# EAGLE schematic hauptplatine (EAGLE 6.5.0)
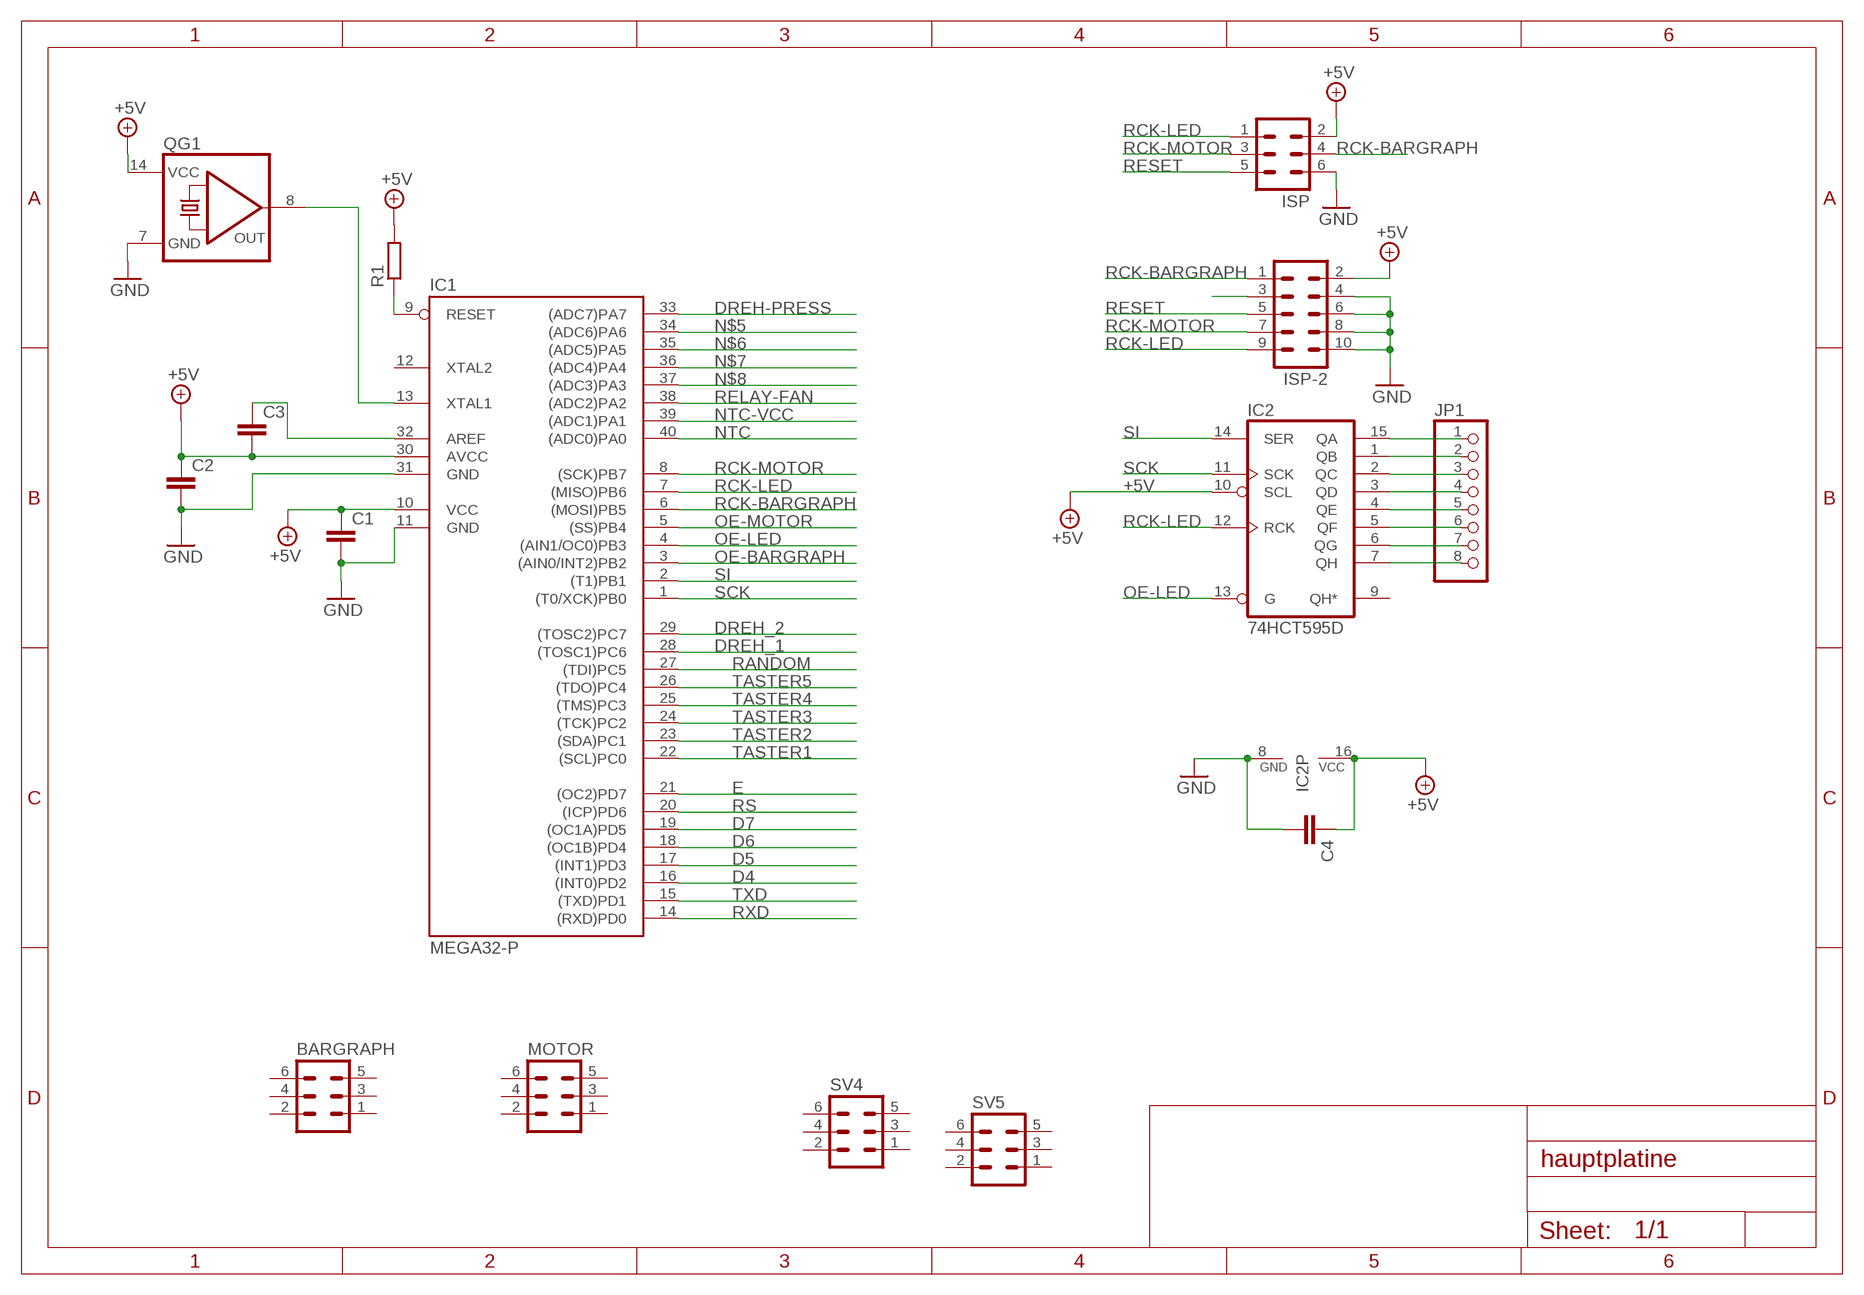
[diagram p0: schematic, sheet 1]

## Parts
BARGRAPH  ML6  [ML6]
C1  C-EU025-025X050  [C025-025X050]
C2  C-EUC0805  [C0805]
C3  C-EUC0805  [C0805]
C4  C-EU025-025X050  [C025-025X050]
IC1  MEGA32-P  [DIL40]
IC2  74HCT595D  [SO16]
ISP  ML6  [ML6]
ISP-2  ML10  [ML10]
JP1  PINHD-1X8  [1X08]
MOTOR  ML6  [ML6]
QG1  QG5860  [DIL14S]
R1  R-EU_0207/10  [0207/10]
SV4  ML6  [ML6]
SV5  ML6  [ML6]

## Nets
+5V: C1.1 C2.1 C3.2 C4.1 IC1.10(VCC) IC1.30(AVCC) IC2.10(SCL) IC2.16(VCC) ISP-2.2 ISP.2 QG1.14(VCC) R1.2
D4: IC1.16((INT0)PD2)
D5: IC1.17((INT1)PD3)
D6: IC1.18((OC1B)PD4)
D7: IC1.19((OC1A)PD5)
DREH-PRESS: IC1.33((ADC7)PA7)
DREH_1: IC1.28((TOSC1)PC6)
DREH_2: IC1.29((TOSC2)PC7)
E: IC1.21((OC2)PD7)
GND: C1.2 C2.2 C4.2 IC1.11(GND) IC1.31(GND) IC2.8(GND) ISP-2.4 ISP-2.6 ISP-2.8 ISP-2.10 ISP.6 QG1.7(GND)
N$1: IC1.13(XTAL1) QG1.8(OUT)
N$2: IC2.15(QA) JP1.1
N$3: IC2.1(QB) JP1.2
N$4: C3.1 IC1.32(AREF)
N$5: IC1.34((ADC6)PA6)
N$6: IC1.35((ADC5)PA5)
N$7: IC1.36((ADC4)PA4)
N$8: IC1.37((ADC3)PA3)
N$9: IC2.2(QC) JP1.3
N$10: IC2.3(QD) JP1.4
N$11: IC2.4(QE) JP1.5
N$12: IC2.5(QF) JP1.6
N$13: IC2.6(QG) JP1.7
N$14: IC2.7(QH) JP1.8
N$16: ISP-2.3
NTC: IC1.40((ADC0)PA0)
NTC-VCC: IC1.39((ADC1)PA1)
OE-BARGRAPH: IC1.3((AIN0/INT2)PB2)
OE-LED: IC1.4((AIN1/OC0)PB3) IC2.13(G)
OE-MOTOR: IC1.5((SS)PB4)
RANDOM: IC1.27((TDI)PC5)
RCK-BARGRAPH: IC1.6((MOSI)PB5) ISP-2.1 ISP.4
RCK-LED: IC1.7((MISO)PB6) IC2.12(RCK) ISP-2.9 ISP.1
RCK-MOTOR: IC1.8((SCK)PB7) ISP-2.7 ISP.3
RELAY-FAN: IC1.38((ADC2)PA2)
RESET: IC1.9(RESET) ISP-2.5 ISP.5 R1.1
RS: IC1.20((ICP)PD6)
RXD: IC1.14((RXD)PD0)
SCK: IC1.1((T0/XCK)PB0) IC2.11(SCK)
SI: IC1.2((T1)PB1) IC2.14(SER)
TASTER1: IC1.22((SCL)PC0)
TASTER2: IC1.23((SDA)PC1)
TASTER3: IC1.24((TCK)PC2)
TASTER4: IC1.25((TMS)PC3)
TASTER5: IC1.26((TDO)PC4)
TXD: IC1.15((TXD)PD1)
Unconnected: BARGRAPH.1 BARGRAPH.2 BARGRAPH.3 BARGRAPH.4 BARGRAPH.5 BARGRAPH.6 IC1.12(XTAL2) IC2.9(QH*) MOTOR.1 MOTOR.2 MOTOR.3 MOTOR.4 MOTOR.5 MOTOR.6 SV4.1 SV4.2 SV4.3 SV4.4 SV4.5 SV4.6 SV5.1 SV5.2 SV5.3 SV5.4 SV5.5 SV5.6

## Library data of the parts
BARGRAPH ISP MOTOR SV4 SV5 = con-harting-ml:ML6: HARTING; OC_FARNELL: unknown; OC_NEWARK: unknown
C1-C4 = rcl:C-EU: CAPACITOR, European symbol
IC1 = atmel:MEGA32-P: MICROCONTROLLER 32 Kbytes FLASH 2 Kbytes SRAM 1 Kbytes EEPROM USART 8-channel 10 bit ADC Source: www.atmel.com .. doc2503.pdf; MPN: ATMEGA32-16PU; OC_FARNELL: 1661729; OC_NEWARK: 51P1794
IC2 = 74xx-eu:74*595: 8-bit SHIFT REGISTER, output latch
ISP-2 = con-harting-ml:ML10: HARTING; OC_FARNELL: unknown; OC_NEWARK: unknown
JP1 = pinhead:PINHD-1X8: PIN HEADER
QG1 = crystal:QG5860: CRYSTAL RESONATOR; OC_FARNELL: unknown; OC_NEWARK: unknown
R1 = rcl:R-EU_: RESISTOR, European symbol